# EasyEDA schematic sch.json
TITLE: Sheet_1; REV: 1.0; Date: 2024-10-16; Sheet: 1/1; Drawn By: neeravgupta07; Company: Your Company
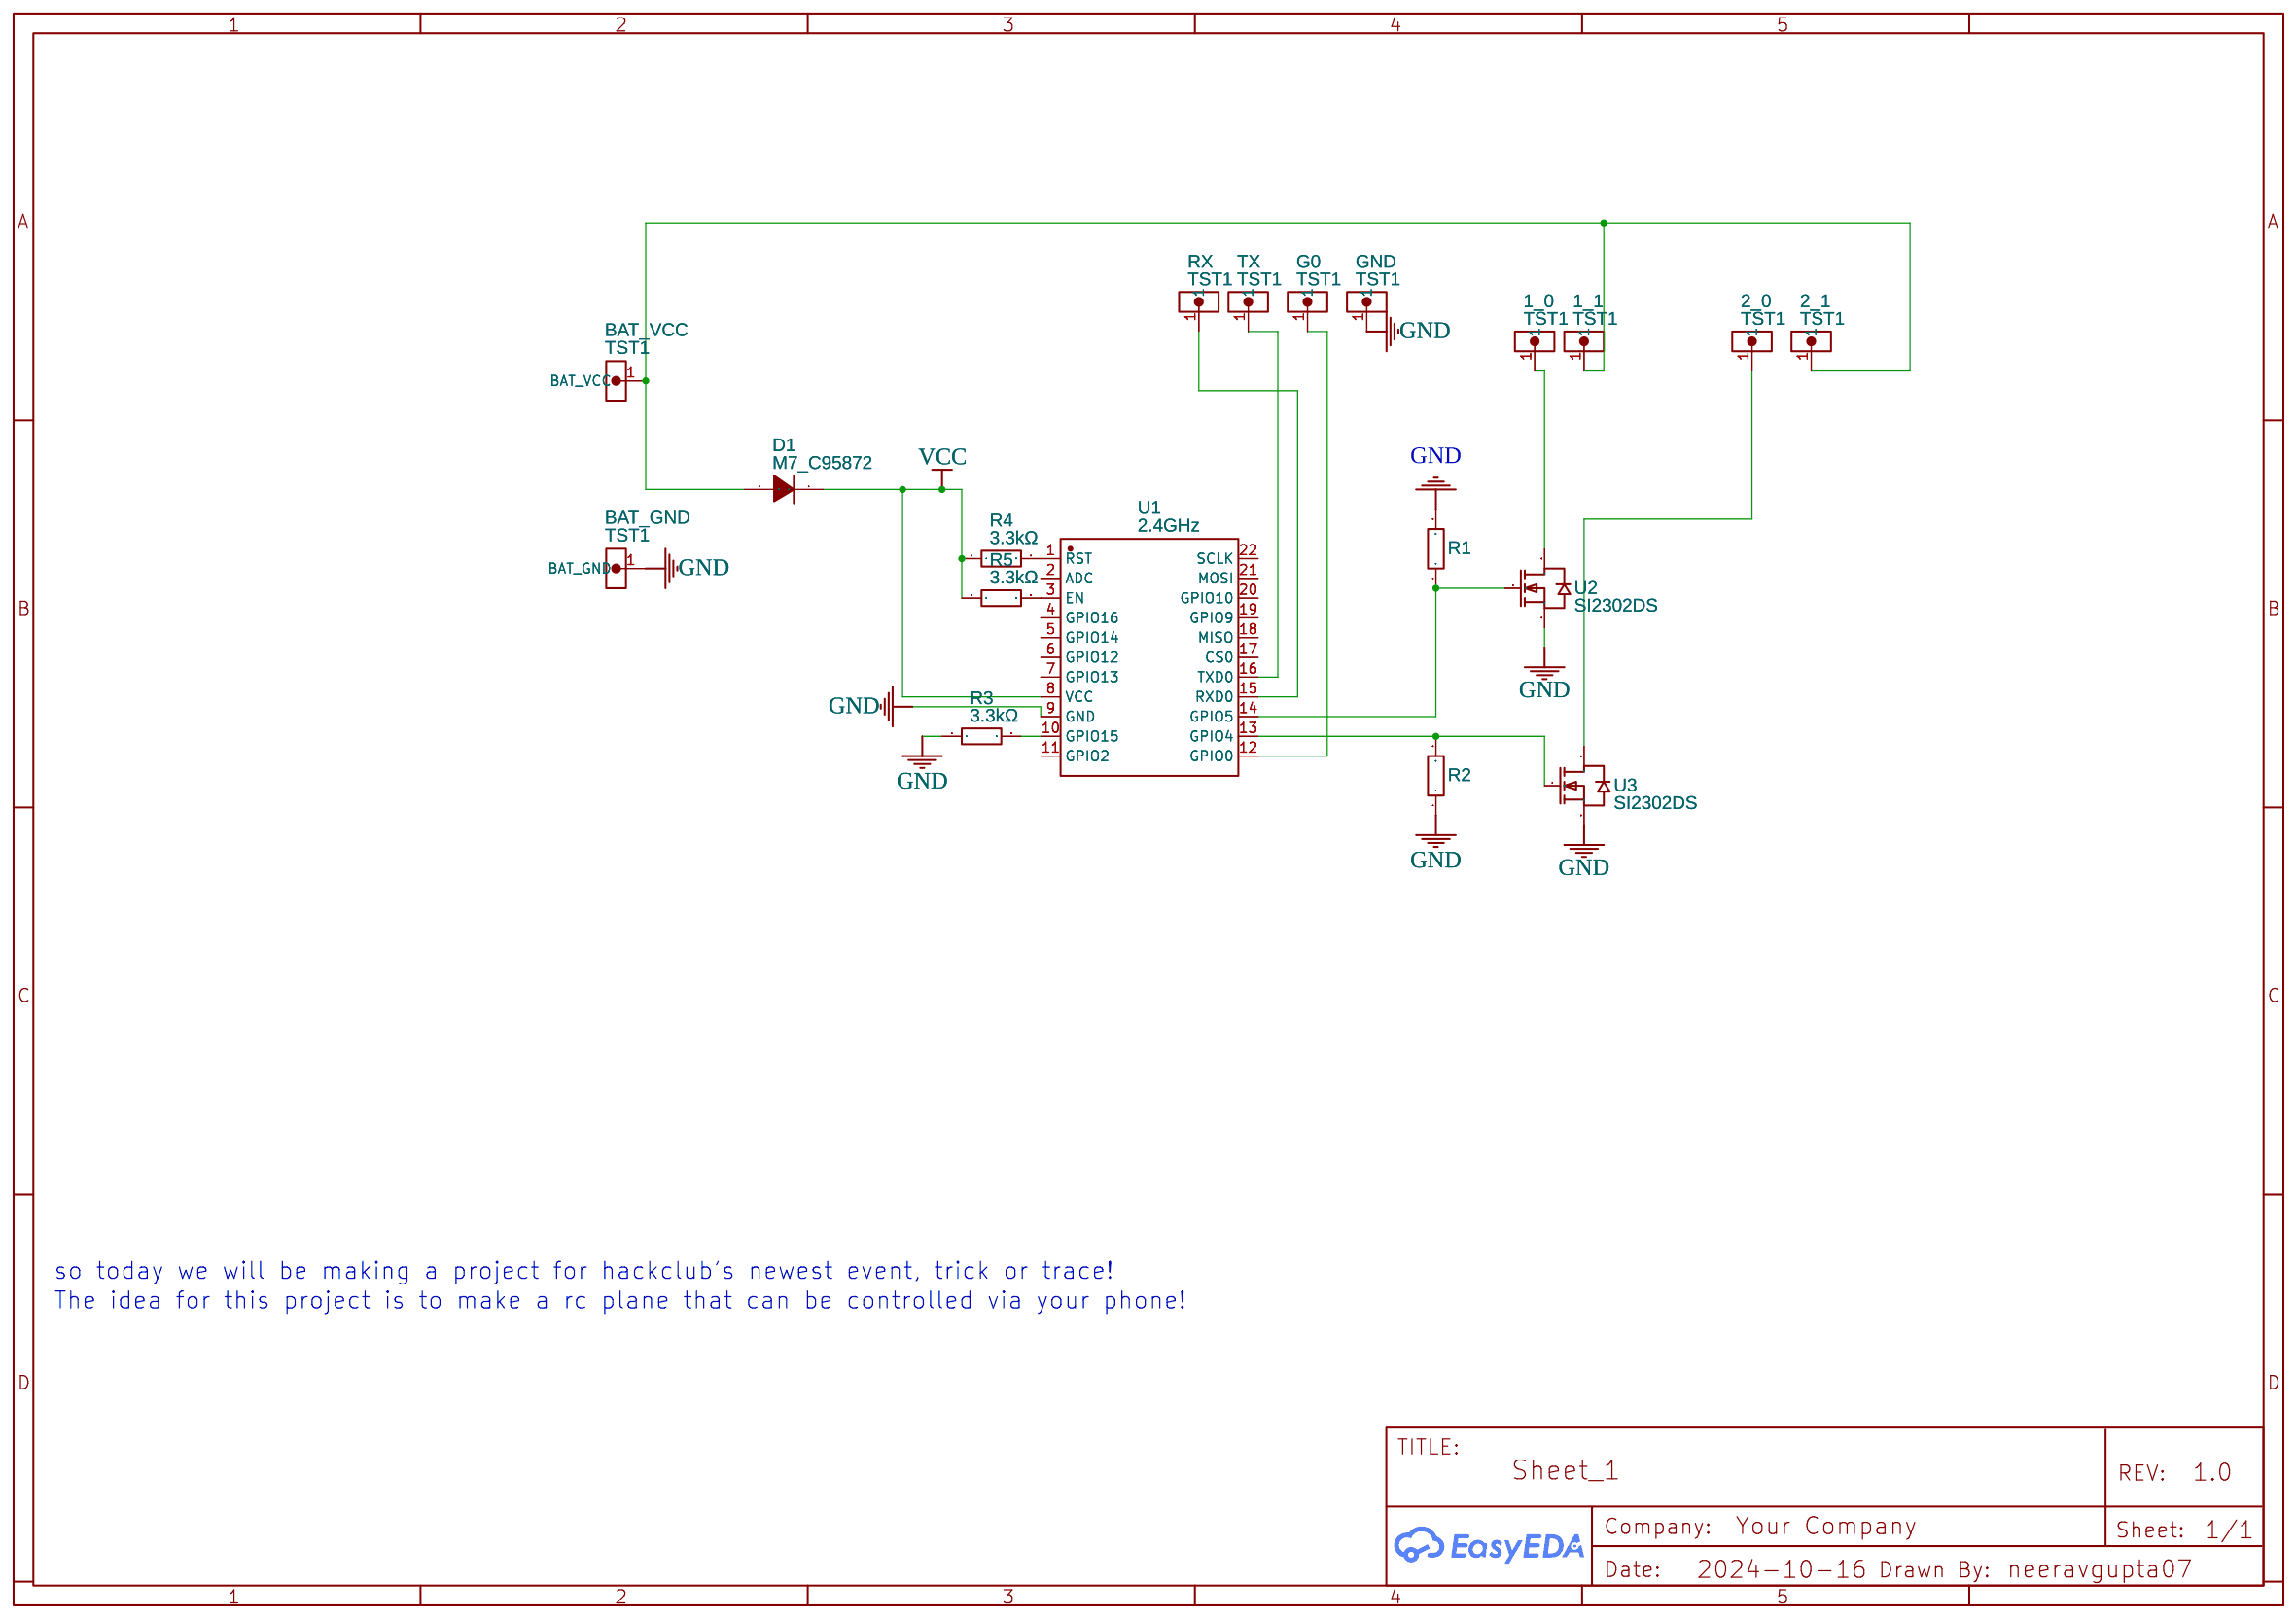
[diagram p0: schematic sheet]

## Parts
1_0  TST1  [1PIN_CONNECTOR PIN1 0X,0Y]
1_1  TST1  [1PIN_CONNECTOR PIN1 0X,0Y]
2_0  TST1  [1PIN_CONNECTOR PIN1 0X,0Y]
2_1  TST1  [1PIN_CONNECTOR PIN1 0X,0Y]
BAT_GND  TST1  [1PIN_CONNECTOR PIN1 0X,0Y]
BAT_VCC  TST1  [1PIN_CONNECTOR PIN1 0X,0Y]
D1  M7_C95872  [SMA_L4.3-W2.6-LS5.2-RD]
G0  TST1  [1PIN_CONNECTOR PIN1 0X,0Y]
GND  TST1  [1PIN_CONNECTOR PIN1 0X,0Y]
R1  3.3kΩ  [R0805]
R2  3.3kΩ  [R0805]
R3  3.3kΩ  [R0805]
R4  3.3kΩ  [R0805]
R5  3.3kΩ  [R0805]
RX  TST1  [1PIN_CONNECTOR PIN1 0X,0Y]
TX  TST1  [1PIN_CONNECTOR PIN1 0X,0Y]
U1  2.4GHz  [WIFIM-SMD_ESP-12F-ESP8266MOD]
U2  SI2302DS  [SOT-23-3_L2.9-W1.3-P1.90-LS2.4-BR]
U3  SI2302DS  [SOT-23-3_L2.9-W1.3-P1.90-LS2.4-BR]

## Library data of the parts
1_0 1_1 2_0 2_1 BAT_GND BAT_VCC G0 GND RX TX = 1PIN_CONNECTOR PIN1 0X,0Y: Manufacturer Part: New SchematicLib; Package Display: No
D1 = M7_C95872: Supplier: LCSC; Manufacturer: MDD(辰达半导体); Manufacturer Part: M7; Supplier Part: C95872; JLCPCB Part Class: Basic Part
R1-R5 = 0805W8F3301T5E: Supplier: LCSC; Manufacturer: UNI-ROYAL(厚声); Supplier Part: C26010; JLCPCB Part Class: Basic Part
U1 = ESP-12F(ESP8266MOD): Supplier: LCSC; Manufacturer: Ai-Thinker(安信可); Supplier Part: C82891; JLCPCB Part Class: Extended Part
U2 U3 = SI2302DS: Contributor: lcsc; Supplier: LCSC; Supplier Part: C5310967; Manufacturer: TECH PUBLIC(台舟)

## Nets
GND: BAT_GND.1(BAT_GND) GND.1 R1.2 R2.1 R3.1 U1.9(GND) U2.2(S) U3.2(S)
VCC: D1.1(K) R4.1 R5.1 U1.8(VCC)
Net-(1_0-1): 1_0.1 U2.3(D)
Net-(1_1-1): 1_1.1 2_1.1 BAT_VCC.1(BAT_VCC) D1.2(A)
Net-(2_0-1): 2_0.1 U3.3(D)
Net-(G0-1): G0.1 U1.12(GPIO0)
Net-(R1-1): R1.1 U1.14(GPIO5) U2.1(G)
Net-(R2-2): R2.2 U1.13(GPIO4) U3.1(G)
Net-(R3-2): R3.2 U1.10(GPIO15)
Net-(R4-2): R4.2 U1.1(RST)
Net-(R5-2): R5.2 U1.3(EN)
Net-(RX-1): RX.1 U1.15(RXD0)
Net-(TX-1): TX.1 U1.16(TXD0)

Not connected (* = marked no-connect by the designer): U1 2(ADC) 4(GPIO16) 5(GPIO14) 6(GPIO12) 7(GPIO13) 11(GPIO2) 17(CS0) 18(MISO) 19(GPIO9) 20(GPIO10) 21(MOSI) 22(SCLK)

## Notes on the sheet
- so today we will be making a project for hackclub's newest event, trick or trace!
- The idea for this project is to make a rc plane that can be controlled via your phone!
